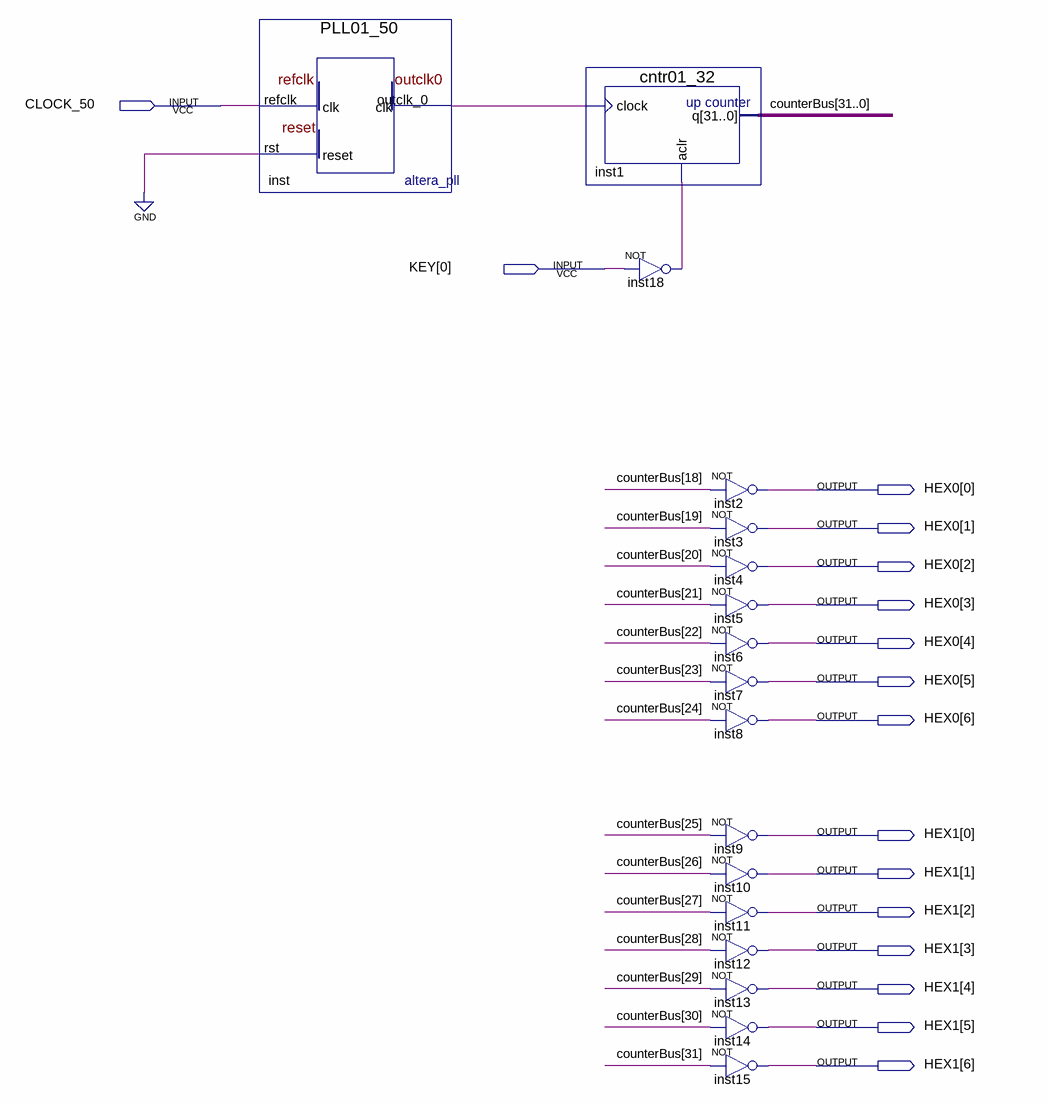
[diagram p0: schematic sheet]
// Quartus schematic GeekCounter.bdf as structural Verilog: 17 symbols, 16 pins
module GeekCounter (
  input  CLOCK_50,
  input  [0:0] KEY,
  output [6:0] HEX0,
  output [6:0] HEX1
);

  wire inst18_out, inst_outclk_0;
  wire [31:0] counterBus;

  PLL01_50 inst (.refclk(CLOCK_50), .rst(1'b0), .outclk_0(inst_outclk_0));
  cntr01_32 inst1 (.clock(inst_outclk_0), .aclr(inst18_out), .q(counterBus));
  not inst18 (inst18_out, KEY[0]);
  not inst2 (HEX0[0], counterBus[18]);
  not inst3 (HEX0[1], counterBus[19]);
  not inst4 (HEX0[2], counterBus[20]);
  not inst5 (HEX0[3], counterBus[21]);
  not inst6 (HEX0[4], counterBus[22]);
  not inst7 (HEX0[5], counterBus[23]);
  not inst8 (HEX0[6], counterBus[24]);
  not inst9 (HEX1[0], counterBus[25]);
  not inst10 (HEX1[1], counterBus[26]);
  not inst11 (HEX1[2], counterBus[27]);
  not inst12 (HEX1[3], counterBus[28]);
  not inst13 (HEX1[4], counterBus[29]);
  not inst14 (HEX1[5], counterBus[30]);
  not inst15 (HEX1[6], counterBus[31]);
endmodule
